# EAGLE design main_brd_2.2 (EAGLE 9.1.0)
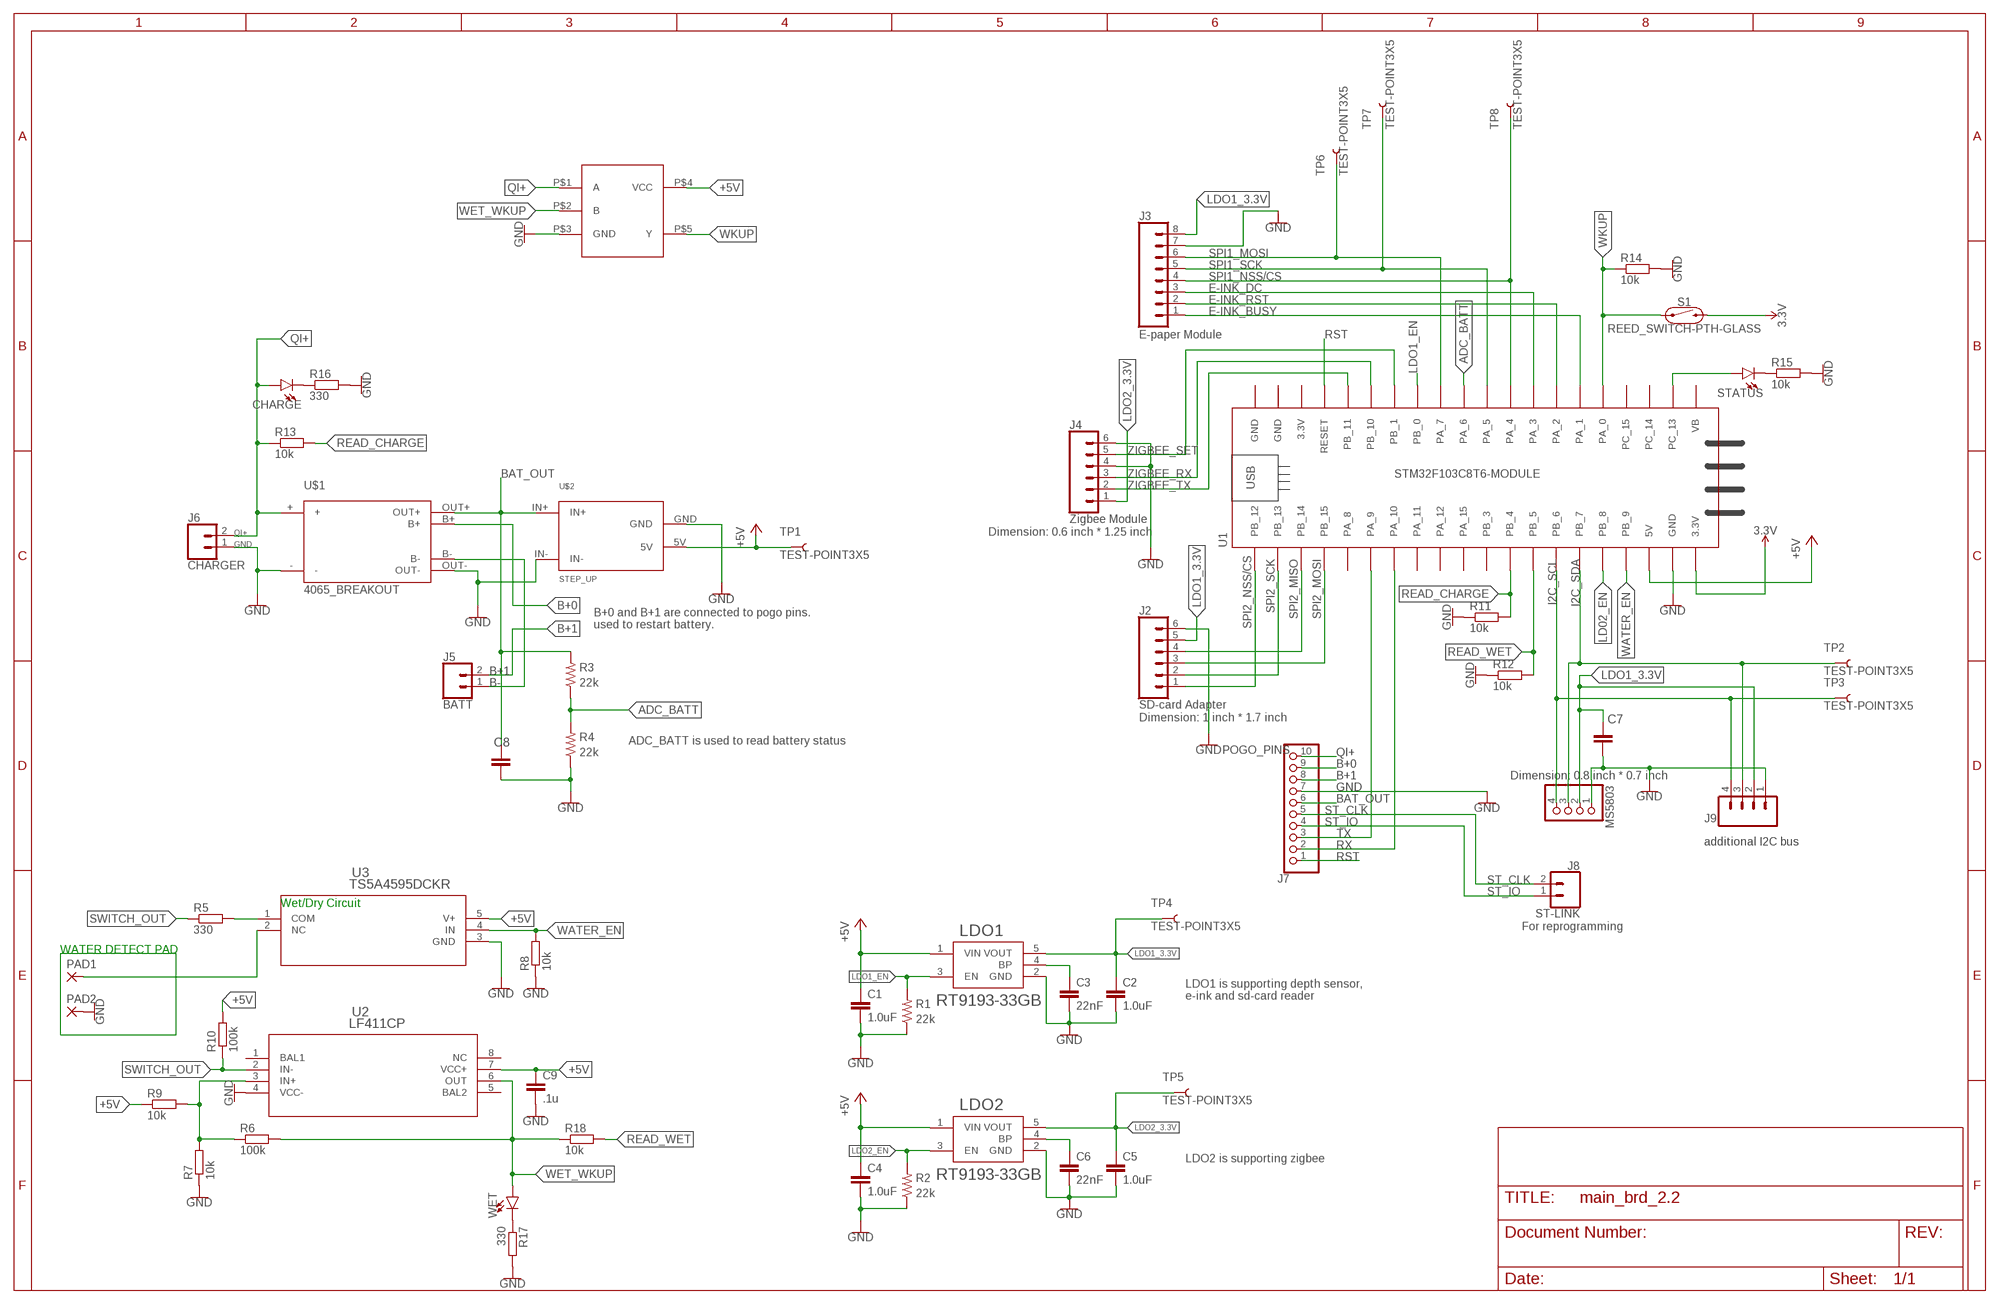
[diagram p0: schematic, sheet 1]

## Parts
C1  1.0uF  1.0UF-0603-16V-10%-X7R  [0603]
C2  1.0uF  1.0UF-0603-16V-10%-X7R  [0603]
C3  22nF  22NF/22,000PF-0603-50V-10%  [0603]
C4  1.0uF  1.0UF-0603-16V-10%-X7R  [0603]
C5  1.0uF  1.0UF-0603-16V-10%-X7R  [0603]
C6  22nF  22NF/22,000PF-0603-50V-10%  [0603]
C7  100u  C-EU025-050X050  [C025-050X050]
C8  220u  C-EU025-050X050  [C025-050X050]
C9  .1u  CC0603  [C0603]
CHARGE  LED5MM  [LED_5MM]
J2  SD-card Adapter  CONN_06SILK_FEMALE_PTH  [1X06]
J3  E-paper Module  CONN_08"  [1X08]
J4  Zigbee Module  CONN_06SILK_FEMALE_PTH  [1X06]
J5  BATT  CONN_02  [1X02]
J6  CHARGER  CONN_02  [1X02]
J7  POGO_PINS  PINHD-1X10  [1X10]
J8  ST-LINK  CONN_02  [1X02]
J9  additional I2C bus  CONN_04PTH  [1X04]
LDO1  RT9193-33GB  [SOT94P279X129-5N]
LDO2  RT9193-33GB  [SOT94P279X129-5N]
MS5803  PINHD-1X4/90  [1X04/90]
PAD1  3,81/1,4  [3,81/1,4]
PAD2  3,81/1,4  [3,81/1,4]
R1  22k  22KOHM-0603-1/10W-1%  [0603]
R2  22k  22KOHM-0603-1/10W-1%  [0603]
R3  22k  22KOHM-0603-1/10W-1%  [0603]
R4  22k  22KOHM-0603-1/10W-1%  [0603]
R5  330  RR0603  [R0603]
R6  100k  RR0603  [R0603]
R7  10k  RR0603  [R0603]
R8  10k  RR0603  [R0603]
R9  10k  RR0603  [R0603]
R10  100k  RR0603  [R0603]
R11  10k  RR0603  [R0603]
R12  10k  RR0603  [R0603]
R13  10k  RR0603  [R0603]
R14  10k  RR0603  [R0603]
R15  10k  RR0603  [R0603]
R16  330  RR0603  [R0603]
R17  330  RR0603  [R0603]
R18  10k  RR0603  [R0603]
S1  REED_SWITCH-PTH-GLASS  [REED_SWITCH_GLASS]
STATUS  LED5MM  [LED_5MM]
TP1  TEST-POINT3X5  [PAD.03X.05]
TP2  TEST-POINT3X5  [PAD.03X.05]
TP3  TEST-POINT3X5  [PAD.03X.05]
TP4  TEST-POINT3X5  [PAD.03X.05]
TP5  TEST-POINT3X5  [PAD.03X.05]
TP6  TEST-POINT3X5  [PAD.03X.05]
TP7  TEST-POINT3X5  [PAD.03X.05]
TP8  TEST-POINT3X5  [PAD.03X.05]
U1  STM32F103C8T6-MODULE  [STM32F103C8T6-MODULE]
U2  LF411CP  [P8]
U3  TS5A4595DCKR  [DCK5]
U$1  4065_BREAKOUT  [CHARGE_MODULE]
U$2  STEP_UP  [STEP_UP_99_69]
U$3  74LVC1G86SE-7  [SOT25]
WET  LED5MM  [LED_5MM]

## Nets
3.3V: S1.P$2 U1.3.3V_1(3.3V)
+5V: C1.1 C4.1 C9.1 LDO1.1(VIN) LDO2.1(VIN) R9.1 R10.2 TP1.P$1 U1.5V U2.7(VCC+) U3.5(V+) U$2.5V U$3.P$4(VCC)
ADC_BATT: R3.1 R4.2 U1.PA_6
B+0: J7.9 U$1.B+
B+1: J5.2 J7.8
B-: J5.1 U$1.B-
BAT_OUT: C8.1 J7.6 R3.2 U$1.OUT+ U$2.IN+
E-INK_BUSY: J3.1 U1.PA_1
E-INK_DC: J3.3 U1.PA_3
E-INK_RST: J3.2 U1.PA_2
GND: C1.2 C2.2 C3.2 C4.2 C5.2 C6.2 C7.2 C8.2 C9.2 J2.6 J3.7 J4.4 J4.6 J6.1 J7.7 J9.1 LDO1.2(GND) LDO2.2(GND) MS5803.1 PAD2.1(P) R1.1 R2.1 R4.1 R7.1 R8.1 R11.1 R12.1 R14.2 R15.2 R16.2 R17.2 U1.GND_1(GND) U2.4(VCC-) U3.3(GND) U$1.- U$1.OUT- U$2.GND U$2.IN- U$3.P$3(GND)
I2C_SCL: J9.4 MS5803.4 TP3.P$1 U1.PB_6
I2C_SDA: J9.3 MS5803.3 TP2.P$1 U1.PB_7
LD02_EN: U1.PB_8
LDO1_3.3V: C2.1 C7.1 J2.5 J3.8 J9.2 LDO1.5(VOUT) MS5803.2 TP4.P$1
LDO1_EN: LDO1.3(EN) R1.2 U1.PB_0
LDO2_3.3V: C5.1 J4.1 LDO2.5(VOUT) TP5.P$1
LDO2_EN: LDO2.3(EN) R2.2
N$1: C6.1 LDO2.4(BP)
N$2: C3.1 LDO1.4(BP)
N$3: CHARGE.K(C) R16.1
N$4: R5.2 U3.1(COM)
N$5: R6.1 R7.2 R9.2 U2.3(IN+)
N$6: STATUS.A U1.PC_13
N$7: R15.1 STATUS.K(C)
N$8: PAD1.1(P) U3.2(NC)
N$10: R17.1 WET.K(C)
QI+: CHARGE.A J6.2 J7.10 R13.1 U$1.+ U$3.P$1(A)
READ_CHARGE: R11.2 R13.2 U1.PB_4
READ_WET: R12.2 R18.2 U1.PB_5
RST: J7.1 U1.RESET
RX: J7.2 U1.PA_10
SPI1_MOSI: J3.6 TP6.P$1 U1.PA_7
SPI1_NSS/CS: J3.4 TP8.P$1 U1.PA_4
SPI1_SCK: J3.5 TP7.P$1 U1.PA_5
SPI2_MISO: J2.4 U1.PB_14
SPI2_MOSI: J2.3 U1.PB_15
SPI2_NSS/CS: J2.1 U1.PB_12
SPI2_SCK: J2.2 U1.PB_13
ST_CLK: J7.5 J8.2
ST_IO: J7.4 J8.1
SWITCH_OUT: R5.1 R10.1 U2.2(IN-)
TX: J7.3 U1.PA_9
WATER_EN: R8.2 U1.PB_9 U3.4(IN)
WET_WKUP: R6.2 R18.1 U2.6(OUT) U$3.P$2(B) WET.A
WKUP: R14.1 S1.P$1 U1.PA_0 U$3.P$5(Y)
ZIGBEE_RX: J4.3 U1.PB_10
ZIGBEE_SET: J4.5 U1.PB_1
ZIGBEE_TX: J4.2 U1.PB_11
Unconnected: U1.3.3V_2(3.3V) U1.GND_2(GND) U1.PA_8 U1.PA_11 U1.PA_12 U1.PA_15 U1.PB_3 U1.PC_14 U1.PC_15 U1.VB U2.1(BAL1) U2.5(BAL2) U2.8(NC)

## Notes on the sheet
- E-paper Module
- Dimension: 0.6 inch * 1.25 inch
- B+0 and B+1 are connected to pogo pins.
  used to restart battery.
- Dimension: 1 inch * 1.7 inch
- ADC_BATT is used to read battery status
- Dimension: 0.8 inch * 0.7 inch
- Wet/Dry Circuit
- For reprogramming
- WATER DETECT PAD
- LDO1 is supporting depth sensor, 
  e-ink and sd-card reader
- LDO2 is supporting zigbee

## Power pins joined to a net without a drawn wire
GND: U1.GND_3(GND)

## Library data of the parts
C1 C2 C4 C5 = SparkFun-Capacitors:1.0UF: 1µF ceramic capacitors A capacitor is a passive two-terminal electrical component used to store electrical energy temporarily in an electric field.; PROD_ID: CAP-13930
C3 C6 = SparkFun-Capacitors:22NF/22,000PF: 0.022uF/22nF/22,000pF ceramic capacitors A capacitor is a passive two-terminal electrical component used to store electrical energy temporarily in an electric field.; PROD_ID: CAP-07885
C7 C8 = rcl:C-EU: CAPACITOR, European symbol; SPICEPREFIX: C
C9 = eagle-ltspice:C: CAPACITOR, European symbol; SPICEMODEL: NONE; SPICEPREFIX: C
CHARGE STATUS WET = SparkFun-LED:LED: LED (Generic) Standard schematic elements and footprints for 5mm, 3mm, 1206, and 0603 sized LEDs. Generic LEDs with no color specified.
J2 J4 = SparkFun-Connectors:CONN_06: Multi connection point. Often used as Generic Header-pin footprint for 0.1 inch spaced/style header connections On any of the 0.1 inch spaced packages, you can populate with these: Break Away Headers - Straight <https://www.sparkfun.com/products/116> (PRT-00116) Break Away Male Headers - Right Angle <https://www.sparkfun.com/products/553> (PRT-00553) Female Headers <https://www.sparkfun.com/products/115> (PRT-00115) Break Away Headers - Machine Pin <https://www.sparkfun.com/products/117> (PRT-00117) Break Away Female Headers - Swiss Machine Pin <https://www.sparkfun.com/products/743> (PRT-00743) Arduino Stackable Header - 6 Pin <https://www.sparkfun.com/products/9280> (PRT-09280) For SCREWTERMINALS and SPRING TERMINALS visit here: Screw Terimnals on SparkFun.com <https://www.sparkfun.com/search/results?term=Screw+Terminals> (5mm/3.5mm/2.54mm spacing) This device is also useful as a general connection point to wire up your design to another part of your project. Our various solder wires solder well into these plated through hole pads. Hook-Up Wire - Assortment (Stranded, 22 AWG) <https://www.sparkfun.com/products/11375> (PRT-11375) Hook-Up Wire - Assortment (Solid Core, 22 AWG) <https://www.sparkfun.com/products/11367> (PRT-11367) View the entire wire category on our website here <https://www.sparkfun.com/categories/141>; PROD_ID: CONN-08437
J3 = SparkFun-Connectors:CONN_08: Multi connection point. Often used as Generic Header-pin footprint for 0.1 inch spaced/style header connections On any of the 0.1 inch spaced packages, you can populate with these: Break Away Headers - Straight <https://www.sparkfun.com/products/116> (PRT-00116) Break Away Male Headers - Right Angle <https://www.sparkfun.com/products/553> (PRT-00553) Female Headers <https://www.sparkfun.com/products/115> (PRT-00115) Break Away Headers - Machine Pin <https://www.sparkfun.com/products/117> (PRT-00117) Break Away Female Headers - Swiss Machine Pin <https://www.sparkfun.com/products/743> (PRT-00743) Arduino Stackable Header - 8 Pin <https://www.sparkfun.com/products/9279> (PRT-09279) For SCREWTERMINALS and SPRING TERMINALS visit here: Screw Terimnals on SparkFun.com <https://www.sparkfun.com/search/results?term=Screw+Terminals> (5mm/3.5mm/2.54mm spacing) This device is also useful as a general connection point to wire up your design to another part of your project. Our various solder wires solder well into these plated through hole pads. Hook-Up Wire - Assortment (Stranded, 22 AWG) <https://www.sparkfun.com/products/11375> (PRT-11375) Hook-Up Wire - Assortment (Solid Core, 22 AWG) <https://www.sparkfun.com/products/11367> (PRT-11367) View the entire wire category on our website here <https://www.sparkfun.com/categories/141> Special notes: Molex polarized connector foot print use with SKU : PRT-08231 with associated crimp pins and housings. 1MM SMD Version SKU: PRT-10208 NOTES ON THE VARIANTS LOCK and LOCK_LONGPADS... This footprint was designed to help hold the alignment of a through-hole component (i.e. 6-pin header) while soldering it into place. You may notice that each hole has been shifted either up or down by 0.005 of an inch from it's more standard position (which is a perfectly straight line). This slight alteration caused the pins (the squares in the middle) to touch the edges of the holes. Because they are alternating, it causes a "brace" to hold the component in place. 0.005 has proven to be the perfect amount of "off-center" position when using our standard breakaway headers. Although looks a little odd when you look at the bare footprint, once you have a header in there, the alteration is very hard to notice. Also,if you push a header all the way into place, it is covered up entirely on the bottom side.; PROD_ID: CONN-08438
J5 J6 J8 = SparkFun-Connectors:CONN_02: Multi connection point. Often used as Generic Header-pin footprint for 0.1 inch spaced/style header connections On any of the 0.1 inch spaced packages, you can populate with these: Break Away Headers - Straight <https://www.sparkfun.com/products/116> (PRT-00116) Break Away Male Headers - Right Angle <https://www.sparkfun.com/products/553> (PRT-00553) Female Headers <https://www.sparkfun.com/products/115> (PRT-00115) Break Away Headers - Machine Pin <https://www.sparkfun.com/products/117> (PRT-00117) Break Away Female Headers - Swiss Machine Pin <https://www.sparkfun.com/products/743> (PRT-00743) For SCREWTERMINALS and SPRING TERMINALS visit here: Screw Terimnals on SparkFun.com <https://www.sparkfun.com/search/results?term=Screw+Terminals> (5mm/3.5mm/2.54mm spacing) This device is also useful as a general connection point to wire up your design to another part of your project. Our various solder wires solder well into these plated through hole pads. Hook-Up Wire - Assortment (Stranded, 22 AWG) <https://www.sparkfun.com/products/11375> (PRT-11375) Hook-Up Wire - Assortment (Solid Core, 22 AWG) <https://www.sparkfun.com/products/11367> (PRT-11367) View the entire wire category on our website here <https://www.sparkfun.com/categories/141> Special notes: Molex polarized connector foot print use with: PRT-08233 with associated crimp pins and housings. 2.54_SCREWTERM for use with PRT-10571. 3.5mm Screw Terminal footprints for PRT-08084 5mm Screw Terminal footprints for use with PRT-08432
J7 = pinhead:PINHD-1X10: PIN HEADER
J9 = SparkFun-Connectors:CONN_04: Multi connection point. Often used as Generic Header-pin footprint for 0.1 inch spaced/style header connections On any of the 0.1 inch spaced packages, you can populate with these: Break Away Headers - Straight <https://www.sparkfun.com/products/116> (PRT-00116) Break Away Male Headers - Right Angle <https://www.sparkfun.com/products/553> (PRT-00553) Female Headers <https://www.sparkfun.com/products/115> (PRT-00115) Break Away Headers - Machine Pin <https://www.sparkfun.com/products/117> (PRT-00117) Break Away Female Headers - Swiss Machine Pin <https://www.sparkfun.com/products/743> (PRT-00743) For SCREWTERMINALS and SPRING TERMINALS visit here: Screw Terimnals on SparkFun.com <https://www.sparkfun.com/search/results?term=Screw+Terminals> (5mm/3.5mm/2.54mm spacing) This device is also useful as a general connection point to wire up your design to another part of your project. Our various solder wires solder well into these plated through hole pads. Hook-Up Wire - Assortment (Stranded, 22 AWG) <https://www.sparkfun.com/products/11375> (PRT-11375) Hook-Up Wire - Assortment (Solid Core, 22 AWG) <https://www.sparkfun.com/products/11367> (PRT-11367) View the entire wire category on our website here <https://www.sparkfun.com/categories/141> Special notes: Molex polarized connector foot print use with SKU : PRT-08231 with associated crimp pins and housings. 1MM SMD Version SKU: PRT-10208; PROD_ID: CONN-09696
LDO1 LDO2 = RT9193-33GB:RT9193-33GB: RT9193 Series 300 mA 3.3 V Ultra-Low Noise Ultra-Fast CMOS LDO Regulator-SC-70-5; DESCRIPTION: RT9193 Series 300 mA 3.3 V Ultra-Low Noise Ultra-Fast CMOS LDO Regulator-SC-70-5; DIGI-KEY_PART_NUMBER: 1028-1014-1-ND; DIGI-KEY_PURCHASE_URL: https://www.digikey.com/product-detail/en/richtek-usa-inc/RT9193-33GB/1028-1014-1-ND/2470073?utm_source=snapeda&utm_medium=aggregator&utm_campaign=symbol; MF: Richtek USA; MP: RT9193-33GB; PACKAGE: SOT-23-5 Richtek
MS5803 = pinhead:PINHD-1X4: PIN HEADER
PAD1 PAD2 = wirepad:3,81/1,4: THROUGH-HOLE PAD
R1-R4 = SparkFun-Resistors:22KOHM: 22kΩ resistor A resistor is a passive two-terminal electrical component that implements electrical resistance as a circuit element. Resistors act to reduce current flow, and, at the same time, act to lower voltage levels within circuits. - Wikipedia; PROD_ID: RES-07853
R5-R18 = eagle-ltspice:R: RESISTOR, European symbol; SPICEMODEL: NONE; SPICEPREFIX: R
S1 = SparkFun-Switches:REED_SWITCH: Reed Switch A reed switch is a magnetically-actuated switch. When the device is exposed to a magnetic field, the two ferrous materials inside the switch pull together and the switch closes. Variant Overview PTH-GLASS Reed Switch <https://www.sparkfun.com/products/8642> (COM-08642) - PTH reed switch w/ glass body (6.0 x 0.9 mm) PTH-INSULATED Reed Switch - Insulated <https://www.sparkfun.com/products/10601> (COM-10601) - PTH reed switch w/ insulated body (15.1 x 4.2 mm); PROD_ID: SWCH-09282; SF_SKU: COM-08642
TP1-TP8 = SparkFun-Connectors:TEST-POINT: SparkFun Test Points Bare copper test points for troubleshooting or In-Circuit-Testing. These are used by our Production team for verifying production board runs using pogo-pins on test beds. SparkFun Products: SparkFun LSM9DS1 Breakout <https://www.sparkfun.com/products/13284> SparkFun PSOC <https://www.sparkfun.com/products/13714> SparkFun Load Cell Amplifier <https://www.sparkfun.com/products/13879>
U1 = stm32f103c8t6_module:STM32F103C8T6-MODULE: STM32F103C8T6 module with ARM Cortex-3, 20kB SRAM, 64kB Flash, 72MHz
U2 = Reef_pin:LF411CP; MANUFACTURER_PART_NUMBER: LF411CP; VENDOR: Texas Instruments
U3 = Reef_pin:TS5A4595DCKR; MANUFACTURER_PART_NUMBER: TS5A4595DCKR; VENDOR: Texas Instruments
U$1 = coral_power:4065_BREAKOUT: TP4056 Micro USB 5V 1A 18650 Lithium Battery Charger Board, with Overcharge Over-Discharge Over-Current Protection
U$2 = coral_power:STEP_UP: Mini DC to DC Voltage Regulator Step Up Boost Converter Power Supply Module 1V-5V to 5V 500mA
U$3 = coral_power:74LVC1G86SE-7

## Module 123
Ports: 

### Library data of the parts

## Board
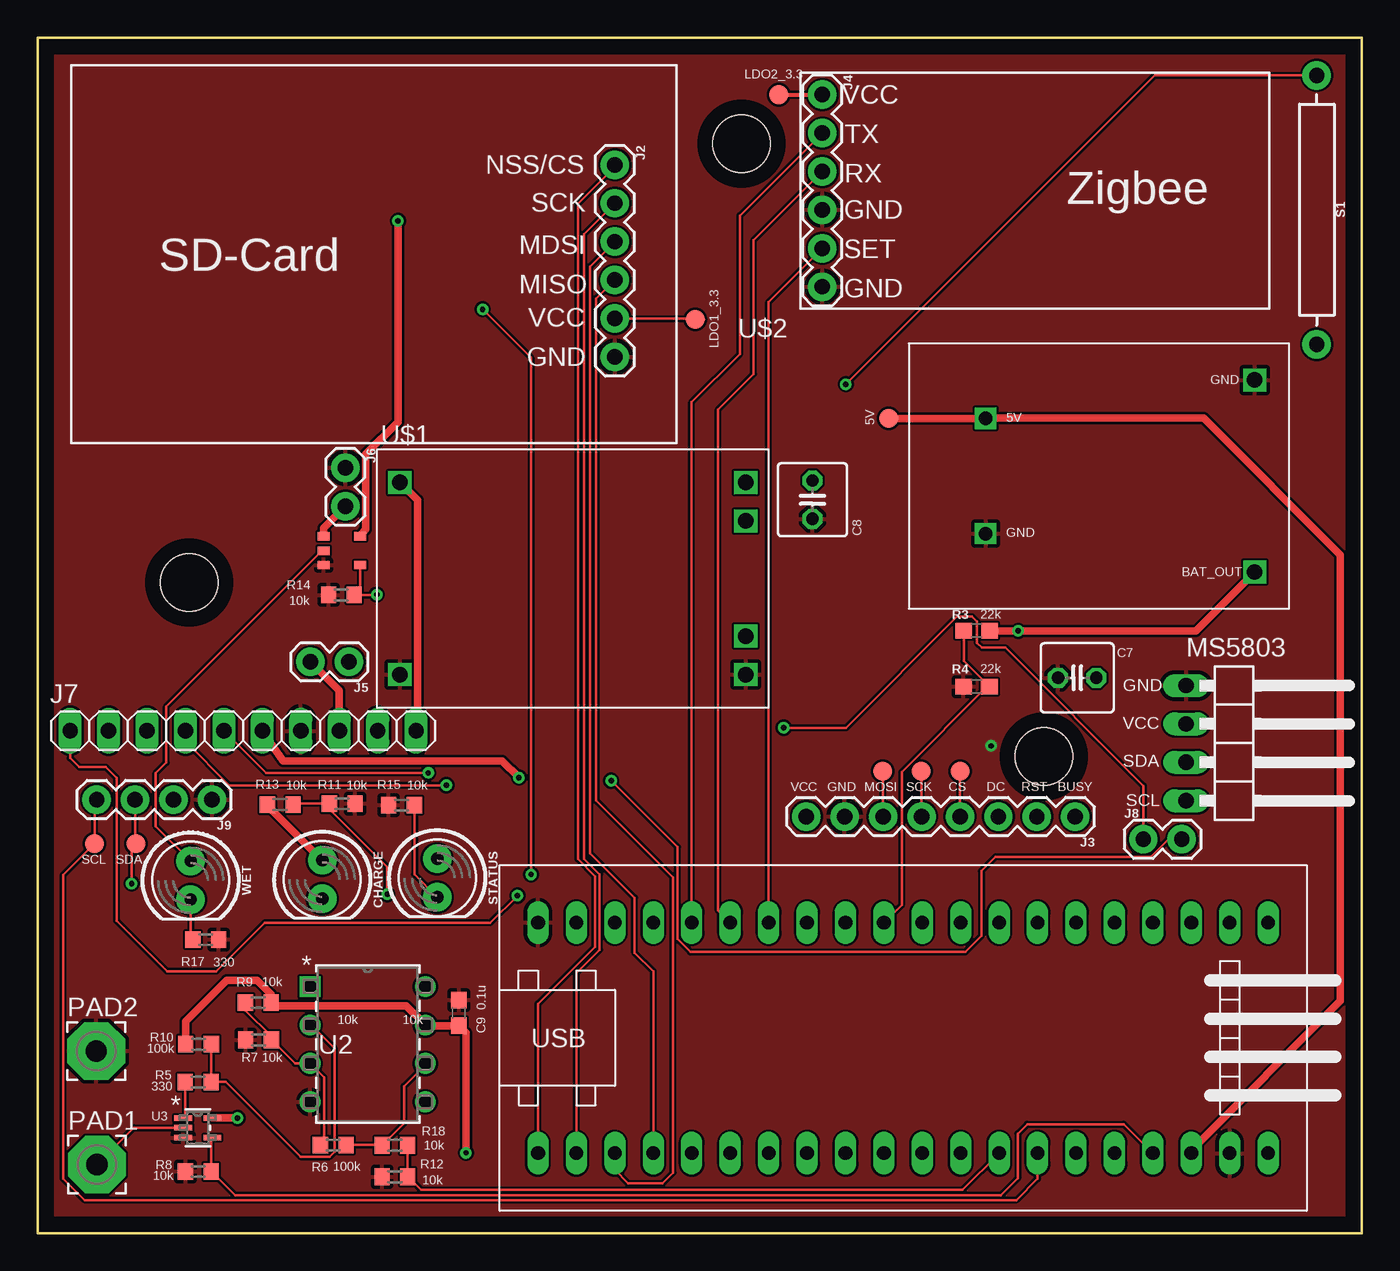
[diagram p1: board, top side]
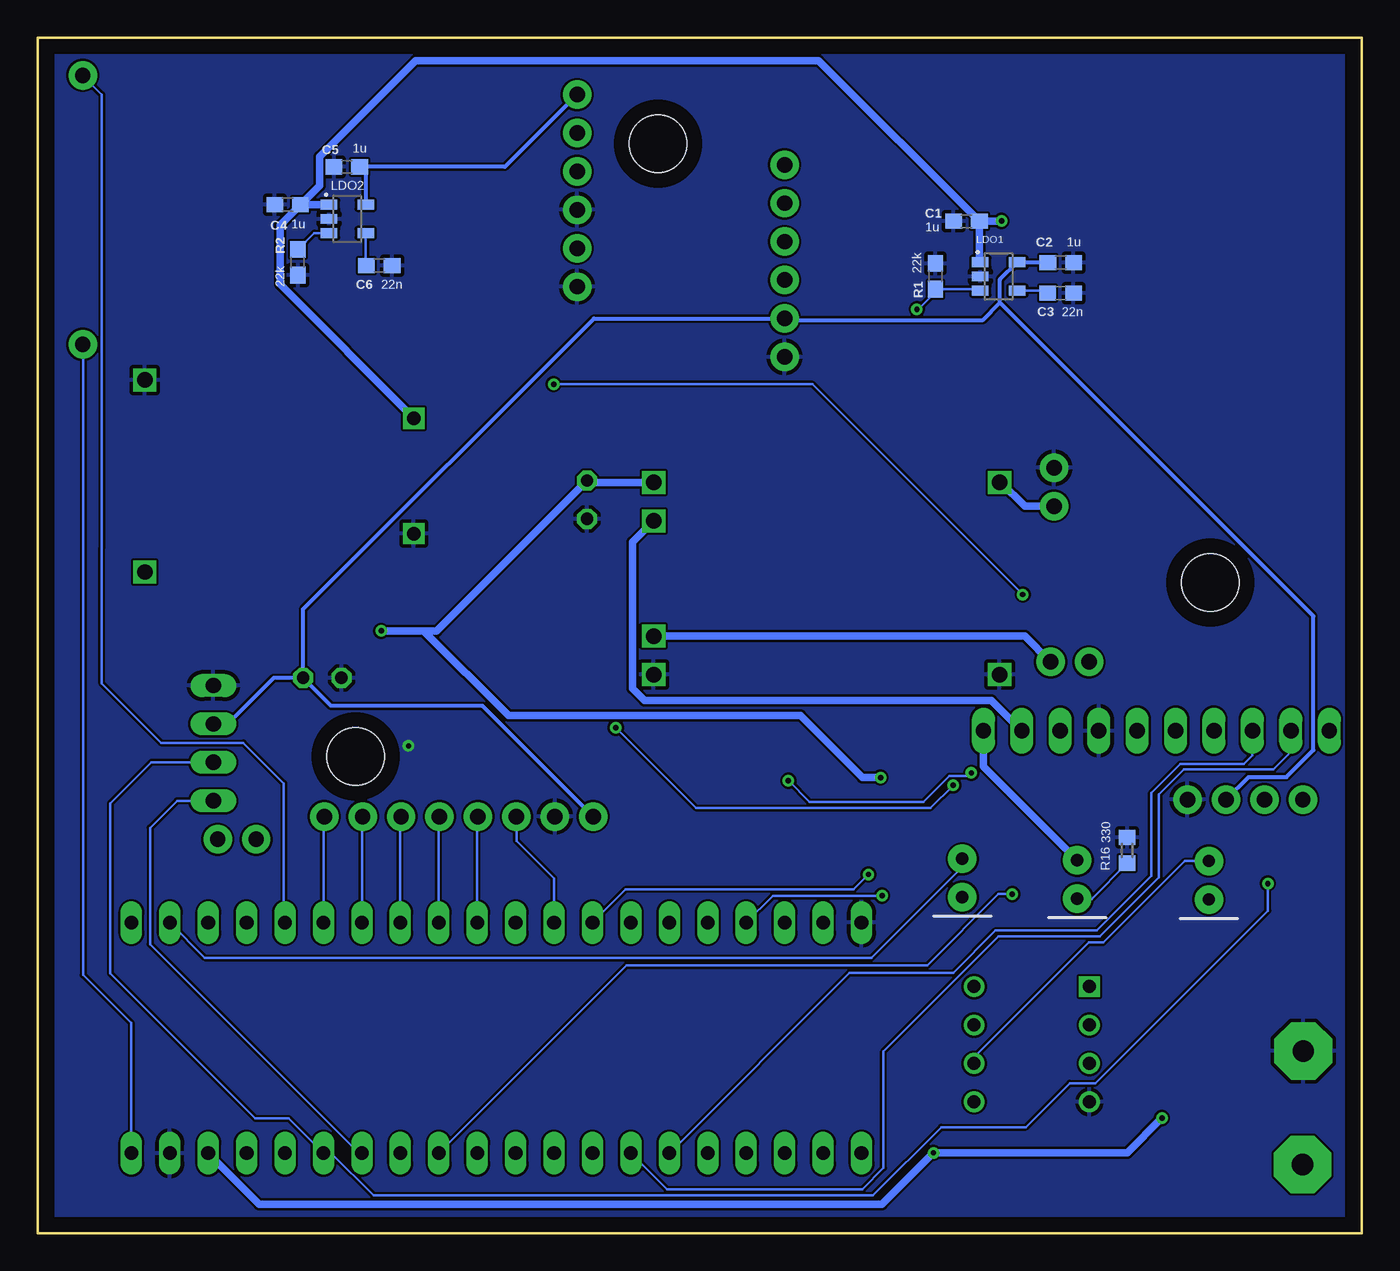
[diagram p2: board, bottom side, seen from below]

Size 87.5 x 79 mm. Coordinates in mm from the lower left corner, seen from the top.
Outline: 0,0 0,79 87.5,79 87.5,0 0,0
Copper layers (1*16): Top 0.035mm / dielectric 1.5mm / Bottom 0.035mm
Design rules "default": minimum track width 6mil, minimum drill 0.35mm, track to track 6mil, track to pad 6mil, pad to pad 6mil, via to via 6mil, smd to smd 6mil, copper to edge 40mil, drill to drill 6mil, minimum pad ring 10mil, minimum via ring 8mil, stop-mask expansion 4mil, vias tented up to drill 0mil, thermal gap 10mil
Holes 3.8 mm at 10,43 46.5,72 66.5,31.5

### Footprints (pad centres in the part's own frame; a part is rotated, then mirrored left to right if it is on the bottom)
0603 = smd 1.1 x 1: 1 -0.85,0; 2 0.85,0
C025-050X050 = drill 0.813 octagon: 1 -1.27,0; 2 1.27,0
C0603 = smd 1.1 x 1: 1 -0.85,0; 2 0.85,0
LED_5MM = drill 0.813 pad 1.88: A -1.27,0; K 1.27,0
1X06 = drill 1.016 pad 1.88: 1 0,0; 2 2.54,0; 3 5.08,0; 4 7.62,0; 5 10.16,0; 6 12.7,0
1X08 = drill 1.016 pad 1.88: 1 0,0; 2 2.54,0; 3 5.08,0; 4 7.62,0; 5 10.16,0; 6 12.7,0; 7 15.24,0; 8 17.78,0
1X02 = drill 1.016 pad 1.88: 1 0,0; 2 2.54,0
1X10 = drill 1.016 long: 1 -11.43,0; 2 -8.89,0; 3 -6.35,0; 4 -3.81,0; 5 -1.27,0; 6 1.27,0; 7 3.81,0; 8 6.35,0; 9 8.89,0; 10 11.43,0
1X04 = drill 1.016 pad 1.88: 1 0,0; 2 2.54,0; 3 5.08,0; 4 7.62,0
SOT94P279X129-5N = smd 1.17 x 0.67: 1 -1.22,0.94; 2 -1.22,0; 3 -1.22,-0.94; 4 1.22,-0.94; 5 1.22,0.94
1X04/90 = drill 1.016 long: 1 -3.81,-3.81; 2 -1.27,-3.81; 3 1.27,-3.81; 4 3.81,-3.81
3,81/1,4 = drill 1.397 pad 3.81 octagon: 1 0,0
R0603 = smd 1 x 1.1: 1 -0.85,0; 2 0.85,0
REED_SWITCH_GLASS = drill 1.016 pad 1.88: P$1 -8.89,0; P$2 8.89,0
PAD.03X.05 = smd 1.27 x 1.27: P$1 0,0
STM32F103C8T6-MODULE = drill 0.9 long: 3.3V_1 25.4,-7.62; 3.3V_2 -17.78,7.62; 5V 20.32,-7.62; GND_1 22.86,-7.62; GND_2 -20.32,7.62; GND_3 -22.86,7.62; PA_0 15.24,7.62; PA_1 12.7,7.62; PA_2 10.16,7.62; PA_3 7.62,7.62; PA_4 5.08,7.62; PA_5 2.54,7.62; PA_6 0,7.62; PA_7 -2.54,7.62; PA_8 -12.7,-7.62; PA_9 -10.16,-7.62; PA_10 -7.62,-7.62; PA_11 -5.08,-7.62; PA_12 -2.54,-7.62; PA_15 0,-7.62; PB_0 -5.08,7.62; PB_1 -7.62,7.62; PB_3 2.54,-7.62; PB_4 5.08,-7.62; PB_5 7.62,-7.62; PB_6 10.16,-7.62; PB_7 12.7,-7.62; PB_8 15.24,-7.62; PB_9 17.78,-7.62; PB_10 -10.16,7.62; PB_11 -12.7,7.62; PB_12 -22.86,-7.62; PB_13 -20.32,-7.62; PB_14 -17.78,-7.62; PB_15 -15.24,-7.62; PC_13 22.86,7.62; PC_14 20.32,7.62; PC_15 17.78,7.62; RESET -15.24,7.62; VB 25.4,7.62
P8 = drill 0.864 pad 1.372 square: 1 -7.62,7.62 | drill 0.864 pad 1.372: 2 -7.62,5.08; 3 -7.62,2.54; 4 -7.62,0; 5 0,0; 6 0,2.54; 7 0,5.08; 8 0,7.62
DCK5 = smd 1.168 x 0.356: 1 -0.965,0.65; 2 -0.965,0; 3 -0.965,-0.65; 4 0.965,-0.65; 5 0.965,0.65
CHARGE_MODULE = drill 1.016 square: + -11.43,6.35; - -11.43,-6.35; B+ 11.43,3.81; B- 11.43,-3.81; OUT+ 11.43,6.35; OUT- 11.43,-6.35
STEP_UP_99_69 = drill 0.9 square: 5V 7.493,-3.81; GND 7.493,3.81 | drill 1.016 square: IN+ -10.287,6.35; IN- -10.287,-6.35
SOT25 = smd 0.55 x 0.8: P$1 0.95,1.2; P$2 0,1.2; P$3 -0.95,1.2; P$4 0.95,-1.2; P$5 -0.95,-1.2

### Placement (x,y rotation side)
C1  26.12,66.87 180 bottom
C2  19.89,64.13 0 bottom
C3  19.9,62.13 0 bottom
C4  70.99,67.97 180 bottom
C5  67.08,70.47 180 bottom
C6  64.93,63.93 0 bottom
C7  68.7,36.7 180 top
C8  51.2,48.47 270 top
C9  27.83,14.55 90 top
CHARGE  18.8,23.37 270 top
J2  38.14,70.61 270 top
J3  68.57,27.53 180 top
J4  51.85,75.25 270 top
J5  20.56,37.75 180 top
J6  20.33,50.58 270 top
J7  13.57,33.2 0 top
J8  73.07,26.03 0 top
J9  11.51,28.65 180 top
LDO1  23.99,63.23 0 bottom
LDO2  67.04,67.03 0 bottom
MS5803  79.71,32.38 270 top
PAD1  3.91,4.53 0 top
PAD2  3.86,12.03 0 top
R1  28.17,63.24 270 bottom
R2  70.31,64.16 90 bottom
R3  62.05,39.81 0 top
R4  62.04,36.11 0 top
R5  10.6,9.98 180 top
R6  19.53,5.82 0 top
R7  14.59,12.77 0 top
R8  10.61,4.07 0 top
R9  14.57,15.23 180 top
R10  10.62,12.48 180 top
R11  20.12,28.38 180 top
R12  23.6,3.72 0 top
R13  16.02,28.32 0 top
R14  20.06,42.18 180 top
R15  24.04,28.28 180 top
R16  15.5,25.3 90 bottom
R17  11.1,19.4 0 top
R18  23.6,5.8 0 top
S1  84.53,67.63 270 top
STATUS  26.4,23.47 270 top
TP1  56.23,53.84 0 top
TP2  6.49,25.74 0 top
TP3  3.75,25.74 0 top
TP4  43.46,60.39 270 top
TP5  48.97,75.24 0 top
TP6  55.83,30.54 0 top
TP7  58.39,30.54 0 top
TP8  60.95,30.54 0 top
U1  55.92,12.9 0 top
U2  25.62,8.67 0 top
U3  10.57,6.96 0 top
U$1  35.36,43.26 0 top
U$2  70.14,50.04 180 top
U$3  20.1,45.1 90 top
WET  10.1,23.32 270 top

### Tracks (layer width: path | path; a pad name or v marks a point on that pad's centre or on a via)
3.3V
  Bottom 0.152: S1.P$2 84.5,58.71 84.5,17.06 81.32,13.88 U1.3.3V_1
+5V  (via drill 0.35)
  Top 0.508: R10.2 9.77,14.01 12.46,16.7 14.5,16.7 15.42,15.78 R9.1 15.62,15.03 24.34,15.03 U2.7 25.67,13.7 C9.1 28.3,13.23 v28.3,5.3 | TP1.P$1 62.64,53.84 U$2.5V 77.05,53.85 86.1,44.8 86.1,15.34 76.24,5.48 U1.5V | v13.2,7.6 v13.19,7.61 U3.5 | v23.8,66.9 23.8,53.6 21.68,51.48 21.68,46.48 21.3,46.11 U$3.P$4
  Bottom 0.508: U1.5V 72.86,1.9 31.7,1.9 v28.3,5.3 15.5,5.3 v13.2,7.6 | C4.1 LDO2.1 | LDO1.1 25.27,64.23 C1.1 | C4.1 71.5,66.61 71.5,62.7 U$2.5V | C4.1 68.89,69.22 68.89,71.14 62.52,77.5 35.9,77.5 C1.1 | C1.1 23.83,66.87 v23.8,66.9
ADC_BATT
  Top 0.152: R3.1 61.2,37.8 R4.2 62.74,36.11 57.1,30.47 57.1,21.7 U1.PA_6
B+0
  Bottom 0.508: J7.9 24.46,35.2 47.4,35.2 48.2,36 48.2,45.66 U$1.B+
B+1
  Top 0.508: J5.2 19.92,35.85 J7.8
B-
  Bottom 0.508: J5.1 22.26,39.45 U$1.B-
BAT_OUT  (via drill 0.35)
  Top 0.508: J7.6 16.22,31.2 30.7,31.2 v31.8,30.1 | R3.2 v64.8,39.8 76.54,39.8 U$2.IN+
  Bottom 0.508: 62,39.8 56.4,34.2 37.1,34.2 33,30.1 v31.8,30.1 | v64.8,39.8 62,39.8 | U$1.OUT+ 51.07,49.61 C8.1 61.14,39.8 62,39.8
E-INK_BUSY
  Bottom 0.152: U1.PA_1 68.62,27.48 J3.1
E-INK_DC
  Bottom 0.152: U1.PA_3 63.54,27.48 J3.3
E-INK_RST
  Bottom 0.152: U1.PA_2 66.08,27.48 J3.2
GND  (via drill 0.35)
  other vias: 63,32.2
  pour Top: -1.8,81.2 89.3,81.2 89.3,-1.7 -1.9,-1.7 -1.9,81.2
  pour Bottom: -1.6,80.8 88.4,80.8 88.4,-0.9 -1.6,-0.9
I2C_SCL
  Top 0.152: J9.4 3.75,28.51 TP3.P$1 1.67,23.66 1.67,3.6 3.1,2.17 64.67,2.17 66.08,3.58 U1.PB_6
  Bottom 0.152: U1.PB_6 66.28,5.28 80.08,19.09 80.08,26.79 78.3,28.57 MS5803.4
I2C_SDA  (via drill 0.35)
  Top 0.152: J9.3 6.43,25.8 TP2.P$1 6.2,25.45 v6.2,23.1
  Bottom 0.152: v6.2,23.1 6.2,21.3 17.6,9.9 19.3,9.9 22.2,7 27.78,7 32.3,2.48 65.31,2.48 68.1,5.28 U1.PB_7 70.92,7.58 73.12,7.58 82.7,17.16 82.7,28.41 80,31.11 MS5803.3
LDO1_3.3V
  Top 0.152: J2.5 43.4,60.45 TP4.P$1
  Bottom 0.152: 22.73,64.13 LDO1.5
  Bottom 0.254: J3.8 58.11,34.85 68.12,34.85 C7.1 | C2.1 22.73,64.13 | 23.9,61.48 23.9,63.04 LDO1.5 | 23.9,61.48 25.03,60.35 38.04,60.35 J2.5 50.75,60.45 69.97,41.23 C7.1 | J9.2 7.47,30.14 4.97,30.14 3.19,31.93 3.19,40.78 23.9,61.48 | C7.1 71.9,36.7 74.95,33.65 MS5803.2
LDO1_EN  (via drill 0.35)
  Top 0.152: v29.4,61.06 32.6,57.86 v32.6,23.7
  Bottom 0.152: v29.4,61.06 29.3,61.06 28.07,62.29 R1.2 25.31,62.39 LDO1.3 | U1.PB_0 48.66,22.7 33.6,22.7 v32.6,23.7
LDO2_3.3V
  Top 0.152: J4.1
  Top 0.254: TP5.P$1 J4.1
  Bottom 0.152: C5.1 65.82,70.06
  Bottom 0.254: J4.1 56.63,70.47 C5.1 | 65.82,70.06 LDO2.5
LDO2_EN
  Bottom 0.152: R2.2 69.23,66.09 LDO2.3
N$1
  Bottom 0.152: LDO2.4 65.82,63.97 C6.1
N$2
  Bottom 0.152: C3.1 20.89,62.29 LDO1.4
N$3
  Bottom 0.152: R16.1 17.85,22.1 CHARGE.K
N$4
  Top 0.152: R5.2 9.75,7.75 U3.1
N$5
  Top 0.152: R6.1 18.91,6.05 18.91,10.3 U2.3 17,11.21 R7.2 15.44,13.01 13.72,14.73 R9.2
N$6
  Bottom 0.152: U1.PC_13 76.46,18.2 32.4,18.2 26.4,24.2 STATUS.A
N$7
  Top 0.152: R15.1 24.89,23.71 STATUS.K
N$8
  Top 0.152: PAD1.1 6.34,6.96 U3.2
N$10
  Top 0.152: WET.K 10.1,19.55 R17.1
QI+
  Top 0.508: CHARGE.A 15.17,28.27 R13.1 | J6.2 18.9,46.61 U$3.P$1 | U$1.+ 25.1,48.44 25.1,35.48 25.1,33.3 J7.10
  Bottom 0.508: CHARGE.A 25,30.84 J7.10 | J6.2 22.26,48.04 23.83,49.61 U$1.+
READ_CHARGE  (via drill 0.35)
  Top 0.152: R13.2 16.93,28.38 R11.2 19.27,28.03 23.1,24.2 v23.1,22.4
  Bottom 0.152: U1.PB_4 48.58,17.7 28.7,17.7 24,22.4 v23.1,22.4
READ_WET
  Top 0.152: R18.2 R12.2 25.33,2.84 61.1,2.84 U1.PB_5
RST  (via drill 0.35)
  Top 0.152: v31.7,22.3 29.9,20.5 15,20.5 11.8,17.3 8.54,17.3 5.2,20.64 5.2,30.09 4.49,30.8 2.74,30.8 2.14,31.4 J7.1
  Bottom 0.152: U1.RESET 38.9,22.3 v31.7,22.3
RX
  Bottom 0.152: U1.PA_10 45.92,2.9 33,2.9 31.6,4.3 31.6,12 24,19.6 17.3,19.6 13.4,23.5 13.4,29 11.75,30.65 5.83,30.65 4.68,31.8 J7.2
SPI1_MOSI
  Top 0.152: J3.6 55.87,30.5 TP6.P$1
  Bottom 0.152: U1.PA_7 53.38,23.44 55.87,25.93 J3.6
SPI1_NSS/CS
  Top 0.152: J3.4 TP8.P$1
  Bottom 0.152: U1.PA_4 61,27.48 J3.4
SPI1_SCK
  Top 0.152: J3.5 58.41,30.52 TP7.P$1
  Bottom 0.152: U1.PA_5 58.46,27.48 J3.5
SPI2_MISO
  Top 0.152: J2.4 36.9,61.75 36.9,28.6 41.98,23.52 41.98,3.98 41.3,3.3 39.02,3.3 38.14,4.18 U1.PB_14
SPI2_MOSI
  Top 0.152: U1.PB_15 40.68,17.3 39.45,18.53 39.45,22.15 36.5,25.1 36.5,63.89 J2.3
SPI2_NSS/CS
  Top 0.152: U1.PB_12 33.06,15.16 36.83,18.93 36.83,23.58 35.7,24.72 35.7,68.03 38.14,70.47 J2.1
SPI2_SCK
  Top 0.152: U1.PB_13 35.6,17.2 37.13,18.73 37.13,23.71 36.1,24.74 36.1,66.03 J2.2
ST_CLK  (via drill 0.35)
  Top 0.152: J8.2 74.72,26.03 73.55,24.86 63.29,24.86 62.35,23.92 62.35,19.63 61.31,18.58 43.13,18.58 42.29,19.43 42.29,25.51 v37.9,29.9 | v25.8,30.41 15.09,30.41 J7.5
  Bottom 0.152: v25.8,30.41 26.01,30.21 27.25,30.21 28.96,28.49 36.49,28.49 v37.9,29.9
ST_IO  (via drill 0.35)
  Top 0.152: v49.3,33.4 53.42,33.4 60.76,40.74 61.74,40.74 62.08,40.41 62.08,39.02 62.4,38.69 63.94,38.69 73.07,29.56 J8.1 | v27,29.6 12.64,29.6 9.76,32.48 J7.4
  Bottom 0.152: v49.3,33.4 44,28.1 28.5,28.1 v27,29.6
SWITCH_OUT
  Top 0.152: R10.1 11.47,9.92 11.45,9.9 R5.1 12.43,9.98 17.37,5.04 19.27,5.04 19.61,5.38 19.61,12.2 18.05,13.75 U2.2
TX
  Bottom 0.152: U1.PA_9 33.84,17.2 27,17.2 24.2,20 17.5,20 13.9,23.6 13.9,29.1 12,31 7.8,31 7.22,31.58 J7.3
WATER_EN
  Top 0.152: U3.4 11.46,6.24 R8.2 13.04,2.49 63.66,2.49 64.77,3.6 64.77,6.57 65.4,7.2 71.78,7.2 U1.PB_9
WET_WKUP
  Top 0.152: U2.6 25.62,11.12 24.2,9.7 24.2,7.25 R18.1 22.73,5.82 R6.2 | WET.A 7.8,26.89 7.8,30.4 8.5,31.1 8.5,34.8 18.8,45.1 U$3.P$2
  Bottom 0.152: WET.A 11.68,24.59 17.07,19.2 18.04,19.2 25.62,11.61 U2.6
WKUP  (via drill 0.35)
  Top 0.152: U$3.P$5 21.3,42.57 R14.1 22.38,42.18 v22.4,42.2 | v53.4,56.1 73.82,76.52 S1.P$1
  Bottom 0.152: U1.PA_0 71.25,20.61 71.25,29.72 73.93,32.4 79.35,32.4 83.26,36.31 83.26,45.3 83.26,75.25 S1.P$1 | v22.4,42.2 36.3,56.1 v53.4,56.1
ZIGBEE_RX
  Top 0.152: J4.3 47.3,65.62 47.3,56.77 44.96,54.43 44.96,21.32 U1.PB_10
ZIGBEE_SET
  Top 0.152: U1.PB_1 48.3,61.54 J4.5
ZIGBEE_TX
  Top 0.152: U1.PB_11 43.22,54.92 46.4,58.1 46.4,67.26 J4.2

### Text on the board
tPlace: LDO2_3.3 | VCC | TX | RX | NSS/CS | Zigbee | SCK | GND | SET | MDSI | SD-Card | GND | MISO | VCC | LDO1_3.3 | GND | GND | 5V | 5V | GND | BAT_OUT | 10k | 22k | 22k | GND | VCC | SDA | VCC | GND | MOSI | SCK | 10k | 10k | 10k | CS | DC | RST | BUSY | SCL | SCL | SDA | 330 | 10k | 0.1u | 10k | 10k | 100k | 10k | 330 | 10k | 10k | 100k | 10k
bPlace: 1u | 1u | 1u | 1u | 22k | 22k | 22n | 22n | 330